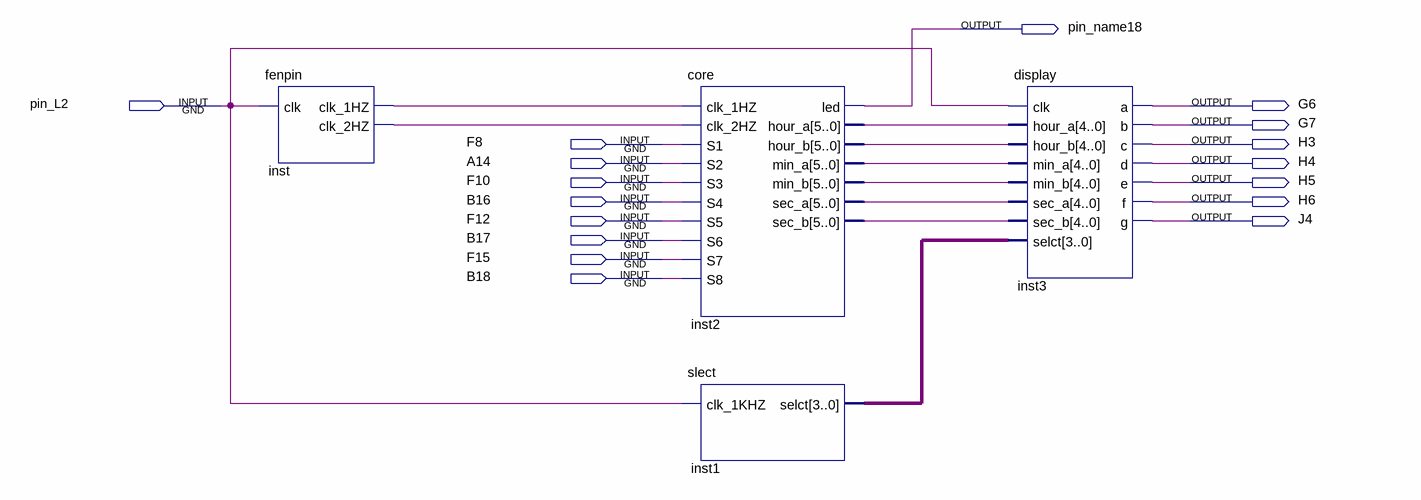
[diagram p0: schematic sheet]
// Quartus schematic sch.bdf as structural Verilog: 4 symbols, 17 pins
module sch (
  input  pin_L2,
  input  F8,
  input  A14,
  input  F10,
  input  B16,
  input  F12,
  input  B17,
  input  F15,
  input  B18,
  output pin_name18,
  output G6,
  output G7,
  output H3,
  output H4,
  output H5,
  output H6,
  output J4
);

  wire inst2_hour_a, inst2_hour_b, inst2_min_a, inst2_min_b, inst2_sec_a, inst2_sec_b, inst_clk_1hz,
       inst_clk_2hz;
  wire [3:0] inst1_selct;

  fenpin inst (.clk(pin_L2), .clk_1HZ(inst_clk_1hz), .clk_2HZ(inst_clk_2hz));
  core inst2 (
    .clk_1HZ(inst_clk_1hz), .clk_2HZ(inst_clk_2hz), .S1(F8), .S2(A14), .S3(F10), .S4(B16), .S5(F12),
    .S6(B17), .S7(F15), .S8(B18), .led(pin_name18), .hour_a(inst2_hour_a), .hour_b(inst2_hour_b),
    .min_a(inst2_min_a), .min_b(inst2_min_b), .sec_a(inst2_sec_a), .sec_b(inst2_sec_b));
  slect inst1 (.clk_1KHZ(pin_L2), .selct(inst1_selct));
  display inst3 (
    .clk(pin_L2), .hour_a({5{inst2_hour_a}}), .hour_b({5{inst2_hour_b}}), .min_a({5{inst2_min_a}}),
    .min_b({5{inst2_min_b}}), .sec_a({5{inst2_sec_a}}), .sec_b({5{inst2_sec_b}}), .selct(inst1_selct),
    .a(G6), .b(G7), .c(H3), .d(H4), .e(H5), .f(H6), .g(J4));
endmodule
